# EasyEDA schematic SCH_Ventilador_2025-02-20.json
TITLE: Sheet_1; REV: 1.0; Date: 2024-12-05; Sheet: 1/1; Drawn By: dsanchez19797; Company: Your Company
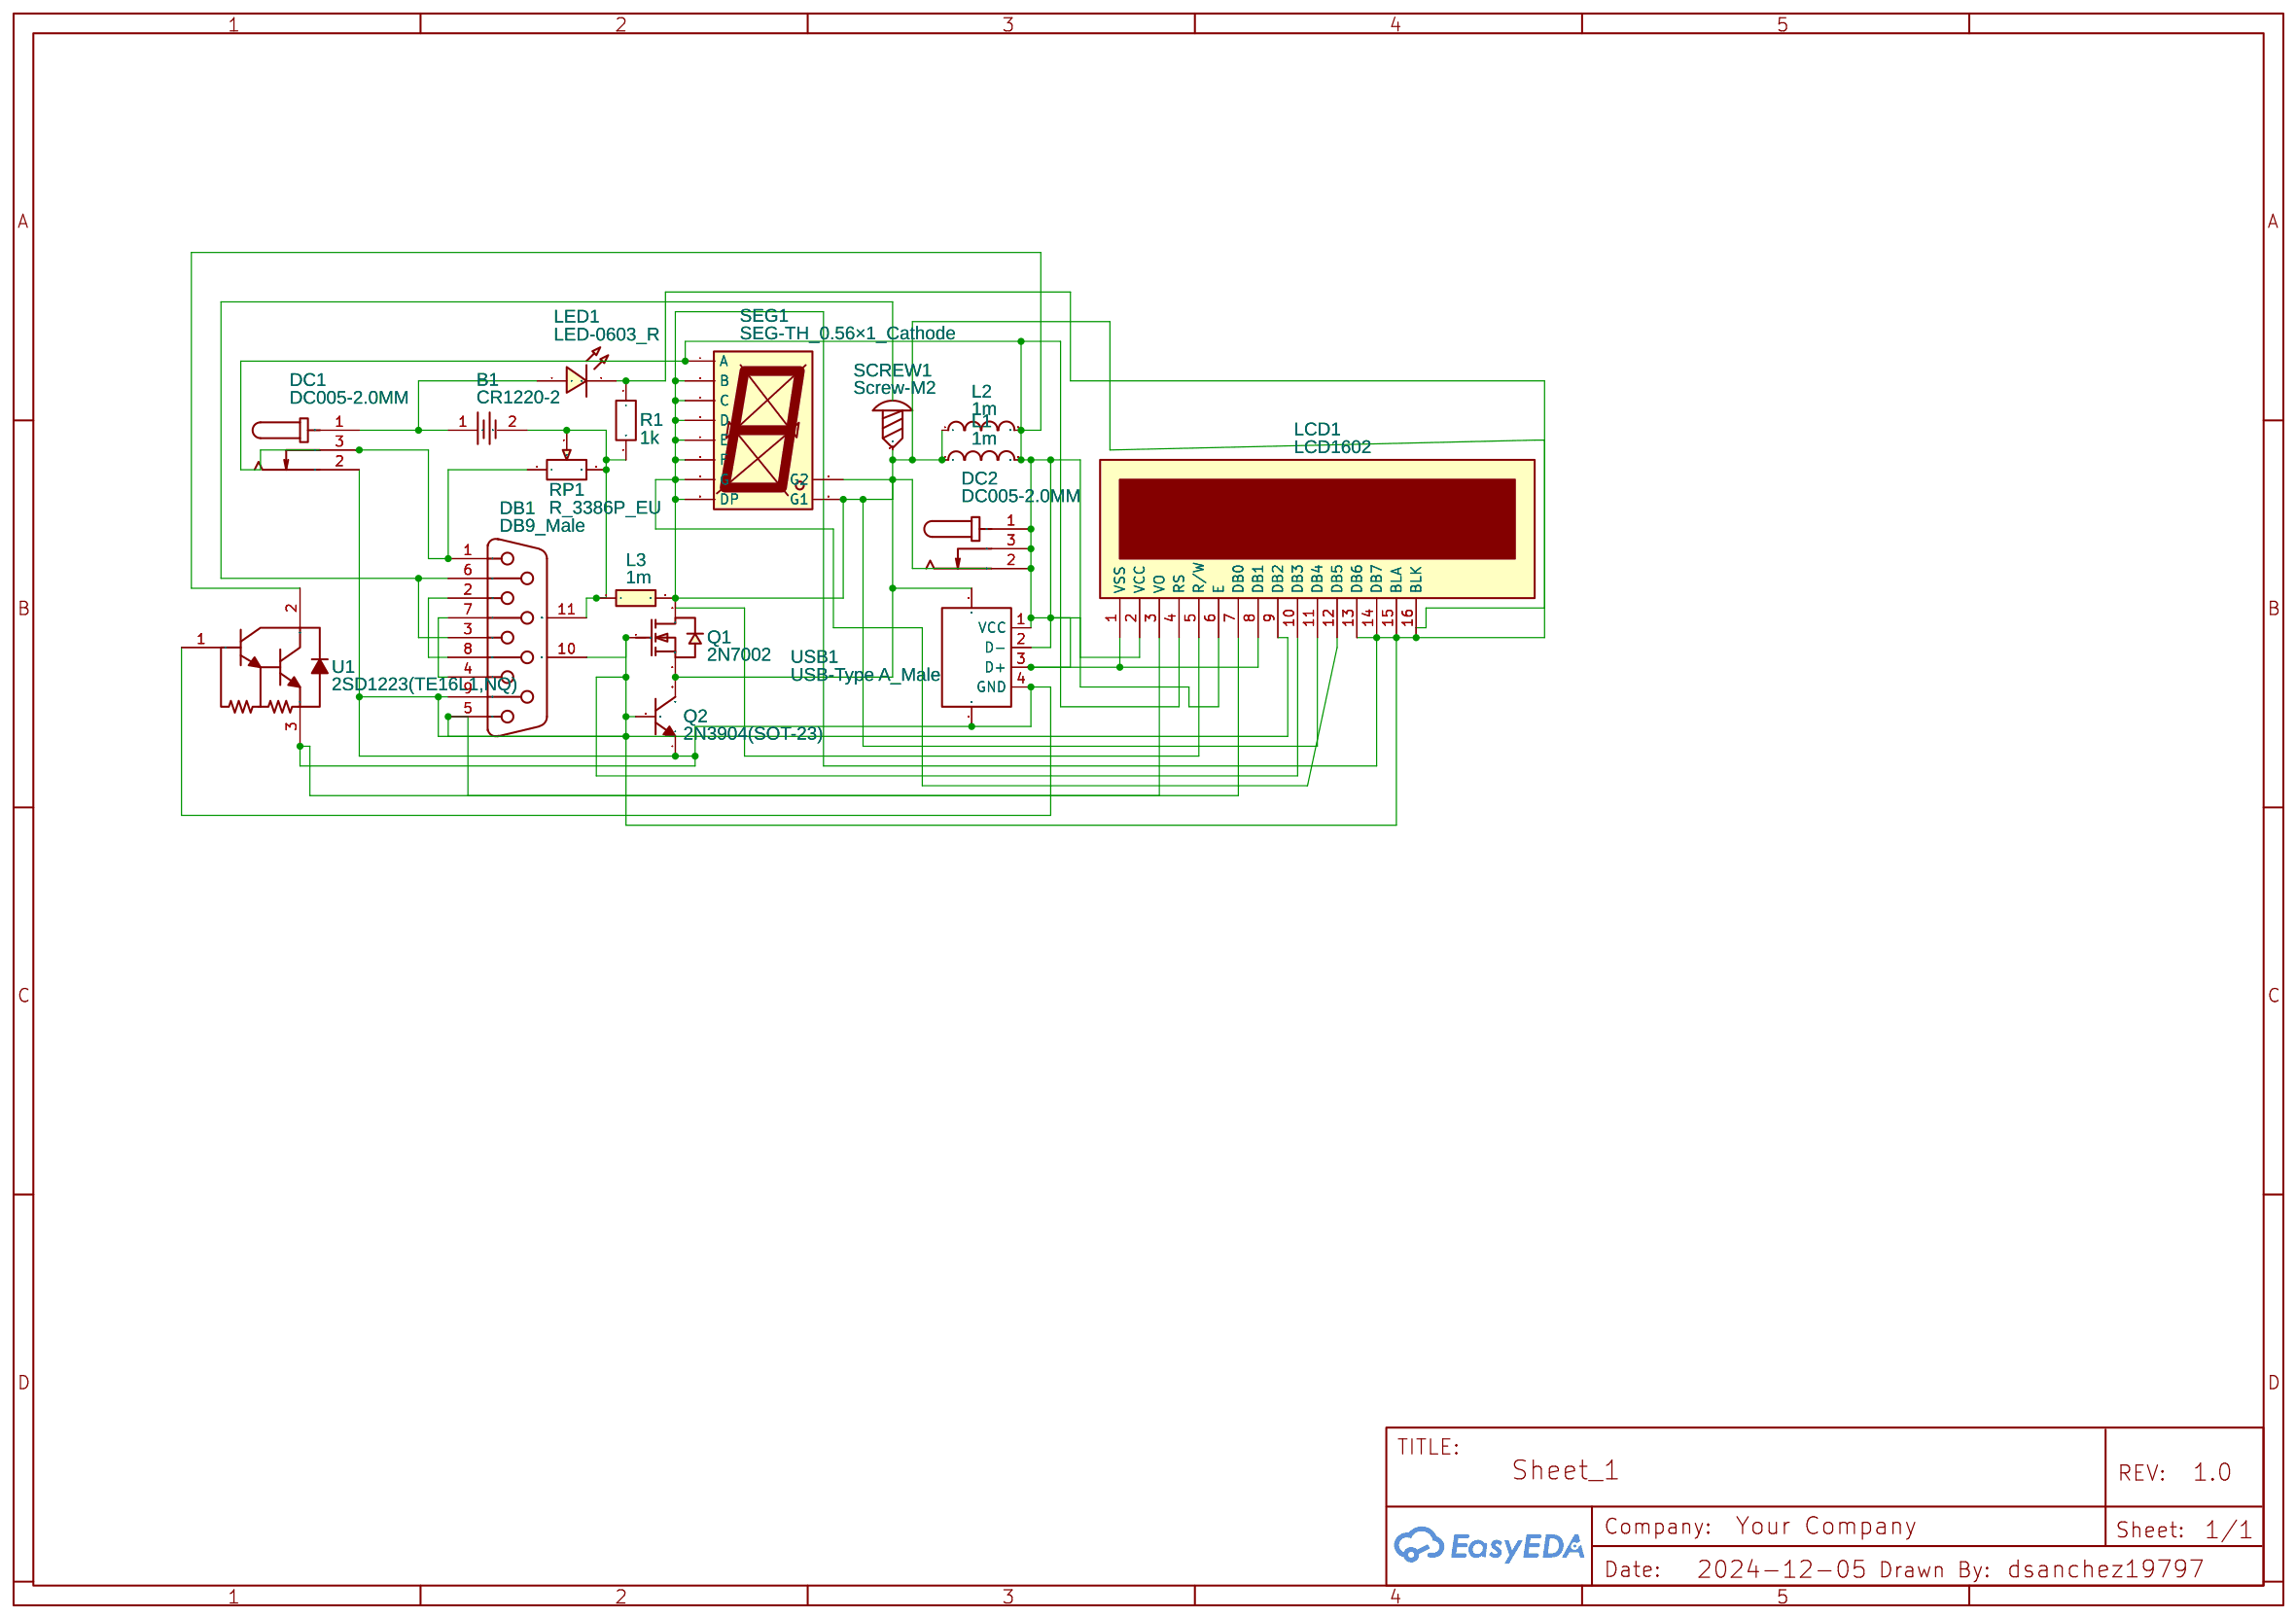
[diagram p0: schematic sheet]

## Parts
B1  CR1220-2  [BAT-SMD_CR1220-2]
DB1  DB9_Male  [DSUB-TH_DMR-9P]
DC1  DC005-2.0MM  [DC-IN-TH_DC005]
DC2  DC005-2.0MM  [DC-IN-TH_DC005]
L1  1m  [L0603]
L2  1m  [L0603]
L3  1m  [L0603]
LCD1  LCD1602  [LCD1602]
LED1  LED-0603_R  [LED0603_RED]
Q1  2N7002  [SOT-23_L2.9-W1.3-P0.95-LS2.4-BR]
Q2  2N3904(SOT-23)  [SOT-23-3_L2.9-W1.3-P1.90-LS2.4-TR]
R1  1k  [R0603]
RP1  R_3386P_EU  [RES-ADJ-TH_3386P]
SCREW1  Screw-M2  [SCREW-M2]
SEG1  SEG-TH_0.56×1_Cathode  [LED-SEG-TH_10P-L12.6-W19.0-P2.54-S15.24-BL]
U1  2SD1223(TE16L1,NQ)  [TO-252-2_L6.6-W6.1-P4.57-LS9.9-BR-CW]
USB1  USB-Type A_Male  [USB-A-TH_48037-0001]

## Library data of the parts
B1 = CR1220-2: Supplier: LCSC; Manufacturer: Q&J; image: //image.lceda.cn/szlcsc/C70381.jpg; Supplier Part: C70381
DB1 = DB9_Male: Supplier Part: C185657; Supplier: LCSC; Manufacturer: Amphenol; Contributor: LCEDA_Lib
DC1 DC2 = DC005-2.0MM: Supplier: LCSC; Manufacturer: SOFNG; Supplier Part: C111567
L1 L2 = L0603_US: Contributor: LCEDA_Lib
L3 = L0603_EU: Contributor: LCEDA_Lib
LCD1 = LCD1602: Manufacturer: LONTECH(厦门龙特); Manufacturer Part: LCM1602K-NSW-BBW; Supplier Part: C83275; Supplier: LCSC; Contributor: LCEDA_Lib
LED1 = LED-0603_R: Manufacturer: EVERLIGHT(台湾亿光); Manufacturer Part: 19-217/R6C-AL1M2VY/3T; Supplier Part: C72044; Supplier: LCSC; Contributor: LCEDA_01
Q1 = 2N7002: Supplier: LCSC; Manufacturer: Nexperia; Manufacturer Part: 2N7002,215; image: //image.lceda.cn/szlcsc/C65189.jpg; Supplier Part: C65189; Paste Type: expand; Contributor: LCEDA_Lib
Q2 = 2N3904(SOT-23): Supplier: LCSC; Manufacturer: KEC; Manufacturer Part: 2n3904S-RTK/PS; Supplier Part: C18536; Paste Type: SOT-23; Contributor: LCEDA_Lib
R1 = R_0603_EU: Contributor: LCEDA_Lib
RP1 = R_3386P_EU: Supplier: LCSC; Contributor: LCEDA_Lib; Value(Ω): 10K
SCREW1 = Screw-M2: Contributor: EasyEDA
SEG1 = SEG-TH_0.56×1_Cathode: Manufacturer: 志浩; Supplier Part: C8093; Contributor: LCEDA_01
U1 = 2SD1223(TE16L1,NQ): Supplier: LCSC; Supplier Part: C5502745; Manufacturer: TOSHIBA(东芝); Contributor: lcsc; JLCPCB Part Class: Extended Part
USB1 = USB-Type A_Male: Supplier Part: C112454; Supplier: LCSC; Manufacturer: SOFNG; Manufacturer Part: USB-05; Contributor: LCEDA_Lib

## Nets
Net-(B1-1): B1.1 DC1.1 LED1.1
Net-(B1-2): B1.2 DB1.11(MH2) L3.1 R1.2 RP1.2 RP1.3
Net-(DB1-1): DB1.1 DB1.5 DB1.9 DB1.10(MH1) DC1.2 DC1.3 DC2.1 DC2.2 DC2.3 L1.1 L1.2 L2.1 L2.2 L3.2 LCD1.1(VSS) LCD1.2(VCC) LCD1.3(VO) LCD1.4(RS) LCD1.5(R/W) LCD1.6(E) LCD1.7(DB0) LCD1.8(DB1) LCD1.9(DB2) LCD1.10(DB3) LCD1.11(DB4) LCD1.12(DB5) LCD1.13(DB6) LCD1.14(DB7) LCD1.15(BLA) LCD1.16(BLK) LED1.2 Q1.1(G) Q1.2(S) Q1.3(D) Q2.1(E) Q2.2(B) Q2.3(C) R1.1 RP1.1 SCREW1.1 SEG1.1(E) SEG1.2(D) SEG1.3(G1) SEG1.4(C) SEG1.5(DP) SEG1.6(B) SEG1.7(A) SEG1.8(G2) SEG1.9(F) SEG1.10(G) U1.1(B) U1.2(C) U1.3(E) USB1.1(VCC) USB1.2(D-) USB1.3(D+) USB1.4(GND) USB1.5 USB1.6
Net-(DB1-2): DB1.2 DB1.8
Net-(DB1-3): DB1.3 DB1.6
Net-(DB1-4): DB1.4 DB1.7
